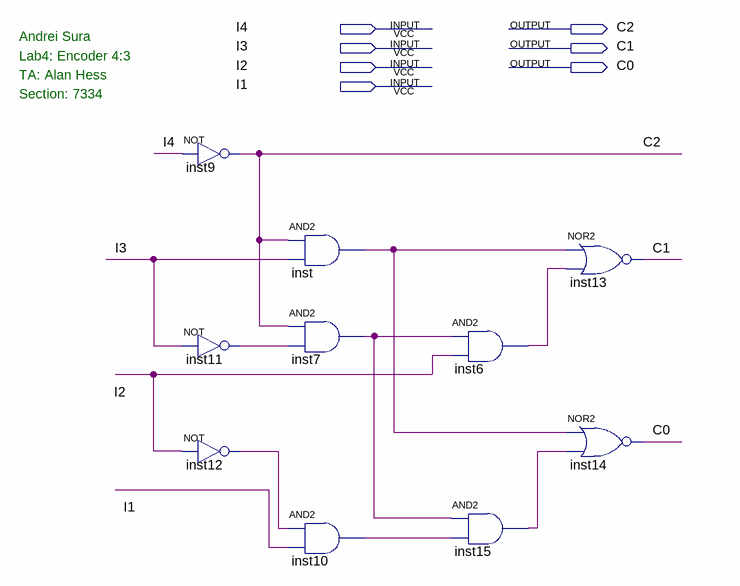
[diagram p0: schematic sheet]
// Quartus schematic lab_4_pencoder.bdf as structural Verilog: 10 symbols, 7 pins
module lab_4_pencoder (
  input  I4,
  input  I3,
  input  I2,
  input  I1,
  output C2,
  output C1,
  output C0
);

  wire inst6_out, inst7_out, inst10_out, inst11_out, inst12_out, inst15_out, inst_out;

  not inst9 (C2, I4);
  not inst11 (inst11_out, I3);
  not inst12 (inst12_out, I2);
  and inst (inst_out, C2, I3);
  and inst7 (inst7_out, C2, inst11_out);
  and inst10 (inst10_out, inst12_out, I1);
  and inst6 (inst6_out, inst7_out, I2);
  and inst15 (inst15_out, inst7_out, inst10_out);
  nor inst13 (C1, inst_out, inst6_out);
  nor inst14 (C0, inst_out, inst15_out);

  // Notes on the sheet:
  //   Andrei Sura
  //   Lab4: Encoder 4:3
  //   TA: Alan Hess
  //   Section: 7334
endmodule
